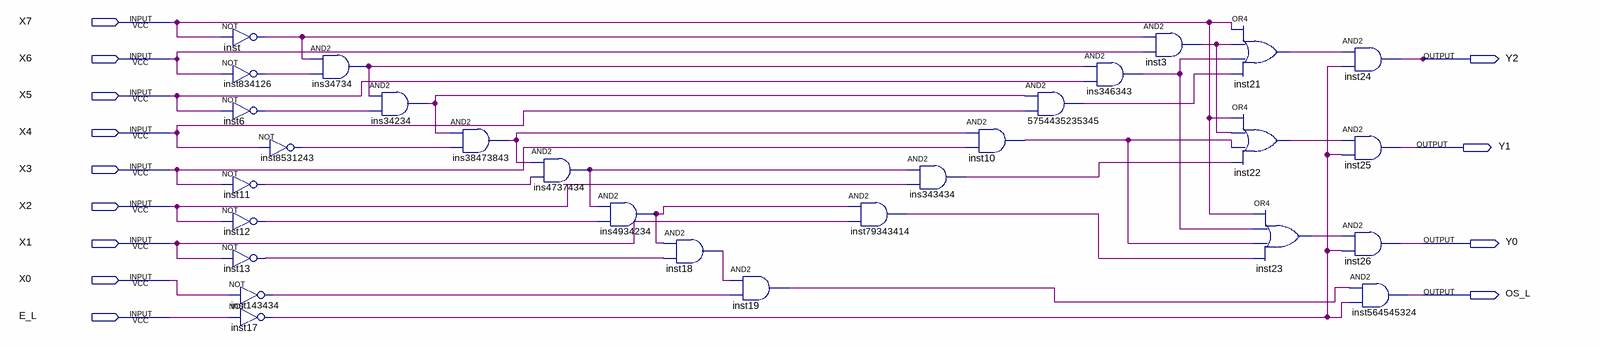
[diagram p0: schematic sheet]
// Quartus schematic PEnc8_3.bdf as structural Verilog: 29 symbols, 13 pins
module PEnc8_3 (
  input  X7,
  input  X6,
  input  X5,
  input  X4,
  input  X3,
  input  X2,
  input  X1,
  input  X0,
  input  E_L,
  output Y2,
  output Y1,
  output Y0,
  output OS_L
);

  wire ins34234_out, ins34734_out, ins343434_out, ins346343_out, ins4737434_out, ins4934234_out,
       ins38473843_out, inst3_out, inst6_out, inst10_out, inst11_out, inst12_out, inst13_out, inst17_out,
       inst18_out, inst19_out, inst21_out, inst22_out, inst23_out, inst143434_out, inst834126_out,
       inst8531243_out, inst79343414_out, inst_out, n5754435235345_out;

  not inst (inst_out, X7);
  not inst834126 (inst834126_out, X6);
  not inst6 (inst6_out, X5);
  not inst11 (inst11_out, X3);
  not inst12 (inst12_out, X2);
  not inst13 (inst13_out, X1);
  not inst143434 (inst143434_out, X0);
  not inst17 (inst17_out, E_L);
  not inst8531243 (inst8531243_out, X4);
  and ins34734 (ins34734_out, inst_out, inst834126_out);
  and ins34234 (ins34234_out, ins34734_out, inst6_out);
  and ins38473843 (ins38473843_out, ins34234_out, inst8531243_out);
  and ins4737434 (ins4737434_out, ins38473843_out, inst11_out);
  and ins4934234 (ins4934234_out, ins4737434_out, inst12_out);
  and inst18 (inst18_out, ins4934234_out, inst13_out);
  and inst19 (inst19_out, inst18_out, inst143434_out);
  and inst79343414 (inst79343414_out, ins4934234_out, X1);
  and ins343434 (ins343434_out, ins4737434_out, X2);
  and inst10 (inst10_out, ins38473843_out, X3);
  and u_5754435235345 (n5754435235345_out, ins34234_out, X4);
  and ins346343 (ins346343_out, ins34734_out, X5);
  and inst3 (inst3_out, inst_out, X6);
  or inst21 (inst21_out, X7, inst3_out, ins346343_out, n5754435235345_out);
  or inst22 (inst22_out, X7, inst3_out, inst10_out, ins343434_out);
  or inst23 (inst23_out, X7, ins346343_out, inst10_out, inst79343414_out);
  and inst24 (Y2, inst21_out, inst17_out);
  and inst25 (Y1, inst22_out, inst17_out);
  and inst26 (Y0, inst23_out, inst17_out);
  and inst564545324 (OS_L, inst19_out, inst17_out);
endmodule
